# EAGLE design AK-MCP2221_V1.0 (EAGLE 7.6.0)
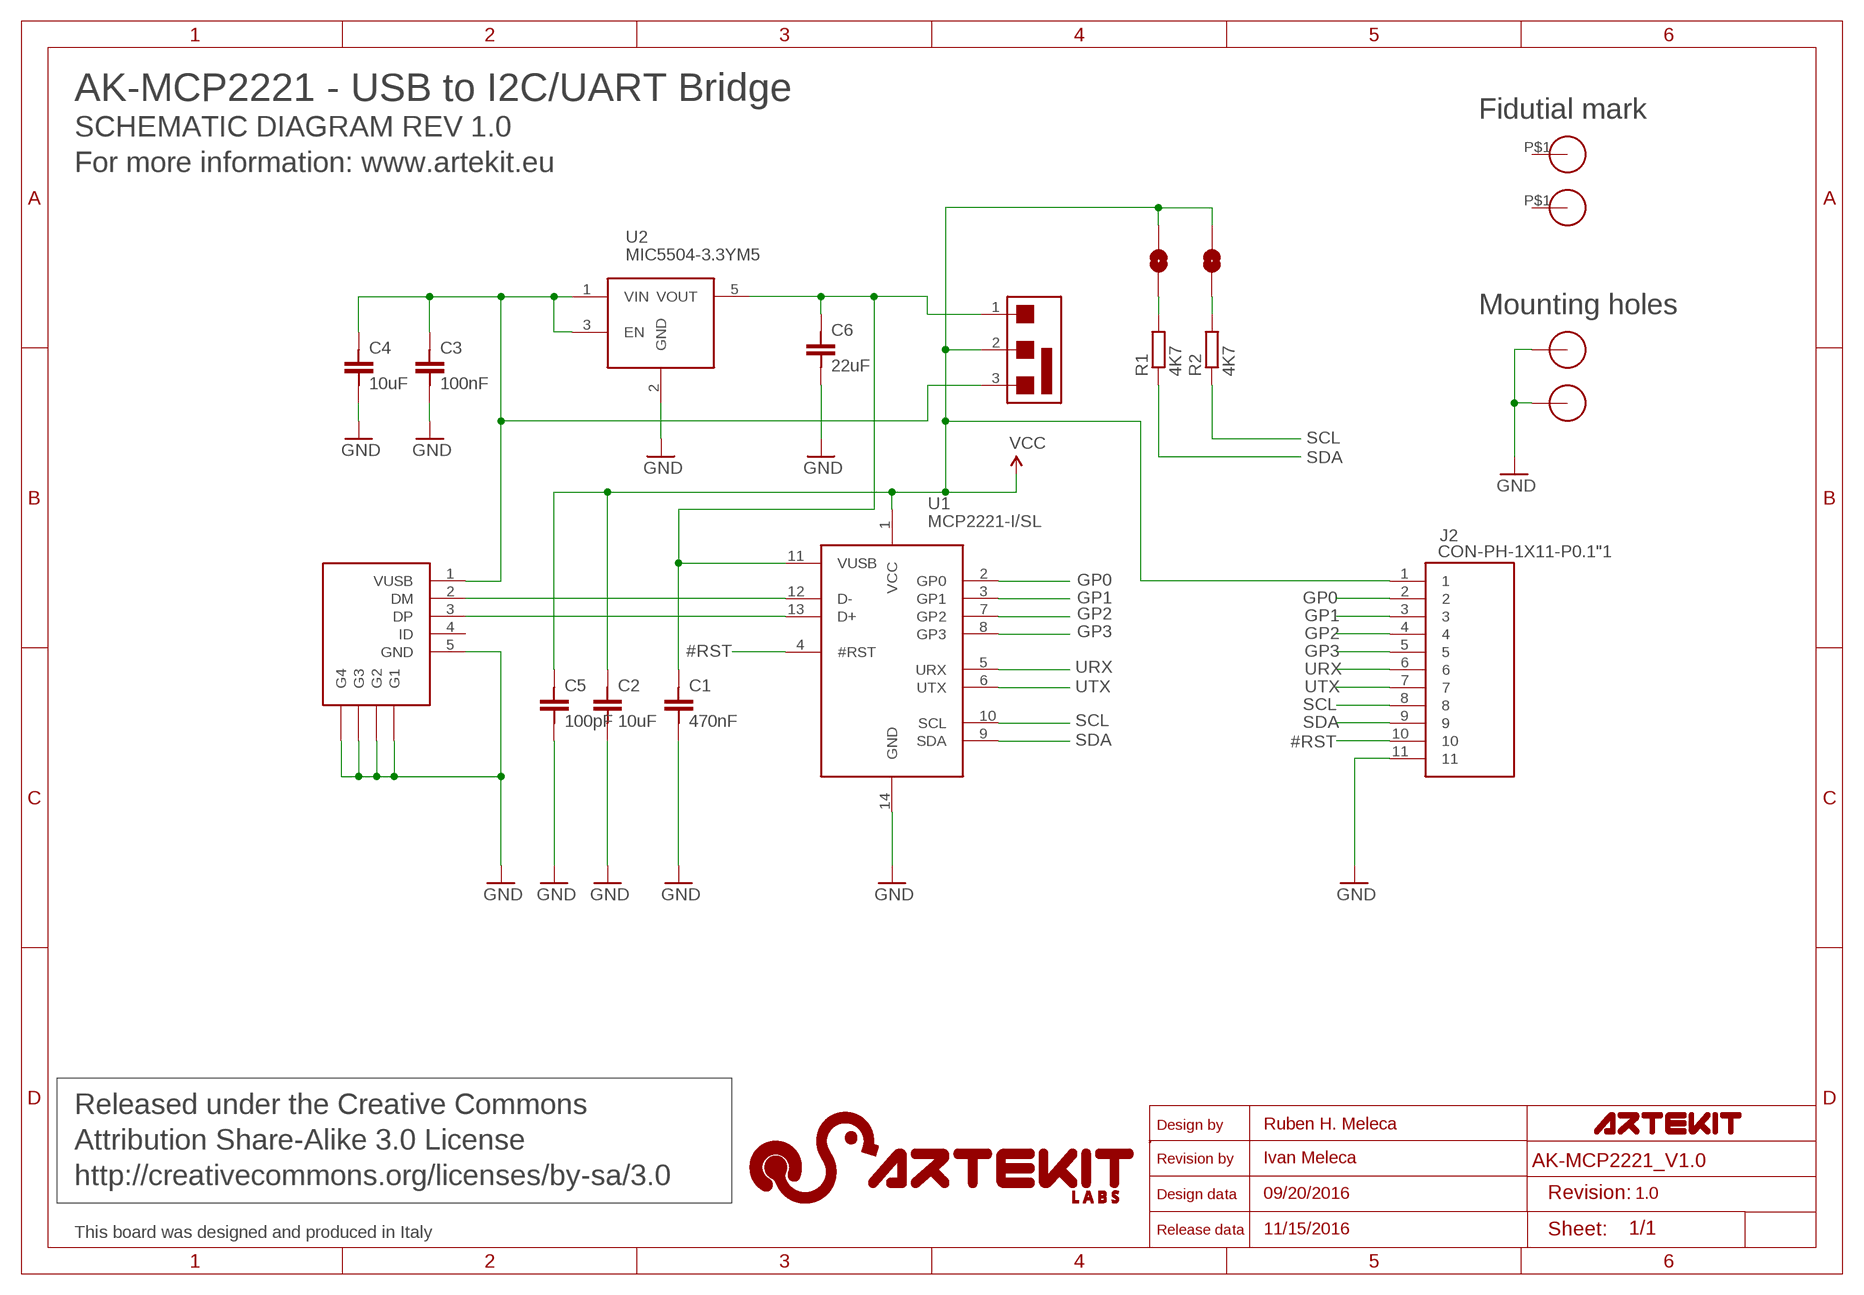
[diagram p0: schematic, sheet 1]

## Parts
C1  470nF  C0603  [C0603]
C2  10uF  C0603  [C0603]
C3  100nF  C0603  [C0603]
C4  10uF  C0805  [C0805]
C5  100pF  C0603  [C0603]
C6  22uF  C0805  [C0805]
J1  JUMPER-1-OPEN  [JUMPER-1-OPEN]
J2  CON-PH-1X11-P0.1"1  [PIN-HEADER-1X11]
J3  JUMPER-1-OPEN  [JUMPER-1-OPEN]
J4  CON-USB-MINI-B-SMD  [CON-USB-MINI-B-SMD]
R1  4K7  R0603  [R0603]
R2  4K7  R0603  [R0603]
SW1  SSSS810701  SLIDE-SWITCH-3-WAY  [SLIDE-SWITCH-3-WAY]
U1  MCP2221-I/SL  [SOICN-14]
U2  MIC5504-3.3YM5  [SOT23-5]
U$2  HOLE-2MM-METALIZED  [HOLE-2MM-METALIZED]
U$3  HOLE-2MM-METALIZED  [HOLE-2MM-METALIZED]
U$4  FIDUTIAL_1.2MM  [FIDUTIAL_1.2MM]
U$5  FIDUTIAL_1.2MM  [FIDUTIAL_1.2MM]

## Nets
#RST: J2.10 U1.4(#RST)
GND: C1.2 C2.2 C3.2 C4.2 C5.2 C6.2 J2.11 J4.5(GND) J4.C(G1) J4.D(G2) J4.E(G3) J4.F(G4) U1.14(GND) U2.2(GND) U$2.1 U$3.1
GP0: J2.2 U1.2(GP0)
GP1: J2.3 U1.3(GP1)
GP2: J2.4 U1.7(GP2)
GP3: J2.5 U1.8(GP3)
N$2: J4.2(DM) U1.12(D-)
N$3: J4.3(DP) U1.13(D+)
N$4: C3.1 C4.1 J4.1(VUSB) SW1.3 U2.1(VIN) U2.3(EN)
N$5: C1.1 C6.1 SW1.1 U1.11(VUSB) U2.5(VOUT)
N$6: J1.1 R1.2
N$7: J3.1 R2.2
SCL: J2.8 R2.1 U1.10(SCL)
SDA: J2.9 R1.1 U1.9(SDA)
URX: J2.6 U1.5(URX)
UTX: J2.7 U1.6(UTX)
VCC: C2.1 C5.1 J1.2 J2.1 J3.2 SW1.2 U1.1(VCC)
Unconnected: J4.4(ID) U$4.P$1 U$5.P$1

## Notes on the sheet
- AK-MCP2221 - USB to I2C/UART Bridge
- Fidutial mark
- SCHEMATIC DIAGRAM REV 1.0
- For more information: www.artekit.eu
- Mounting holes
- Released under the Creative Commons
- Ruben H. Meleca
- Attribution Share-Alike 3.0 License
- Ivan Meleca
- http://creativecommons.org/licenses/by-sa/3.0
- 09/20/2016 | 1.0
- This board was designed and produced in Italy | 11/15/2016

## Library data of the parts
C1-C3 C5 = ak:C0603: CAP SMD 0603 NP; MF: unknown; MPN: unknown
C4 = ak:C0805: CAP SMD 0805 NP; MF: unknown; MPN: unknown
C6 = artekit:C0805: CAP SMD 0805 NP; MF: unknown; MPN: unknown
J1 J3 = artekit:JUMPER-1-OPEN
J2 = ak:CON-PH-1X11-P0.1"
J4 = ak:CON-USB-MINI-B-SMD: USB-MINI SMD Connector; MF: EDAC; MPN: 690-005-299-143; OC_MOUSER: 587-690-005-299-143
R1 R2 = artekit:R0603: RES SMD 0603; MF: unknown; MPN: unknown
SW1 = artekit:SLIDE-SWITCH-3-WAY: 3-Way SMD Slide Switch; MF: ALPS; MPN: SSSS810701; OC_MOUSER: 688-SSSS810701
U1 = ak:MCP2221-I/SL: USB Interface IC USB to I2C Bridge Device; MF: Silicon Laboratories; MPN: MCP2221-I/SL
U2 = ak:MIC5504-3.3YM5: LDO Voltage Regulators Single 300mA LDO; MF: Micrel; MPN: MIC5504-3.3YM5; OC_MOUSER: 998-MIC5504-3.3YM5TR
U$2 U$3 = ak:HOLE-2MM-METALIZED: Metalized hole 2mm
U$4 U$5 = ak:FIDUTIAL_1.2MM

## Net classes
0 default: width 0.203 mm
1 power: width 0.254 mm

## Board
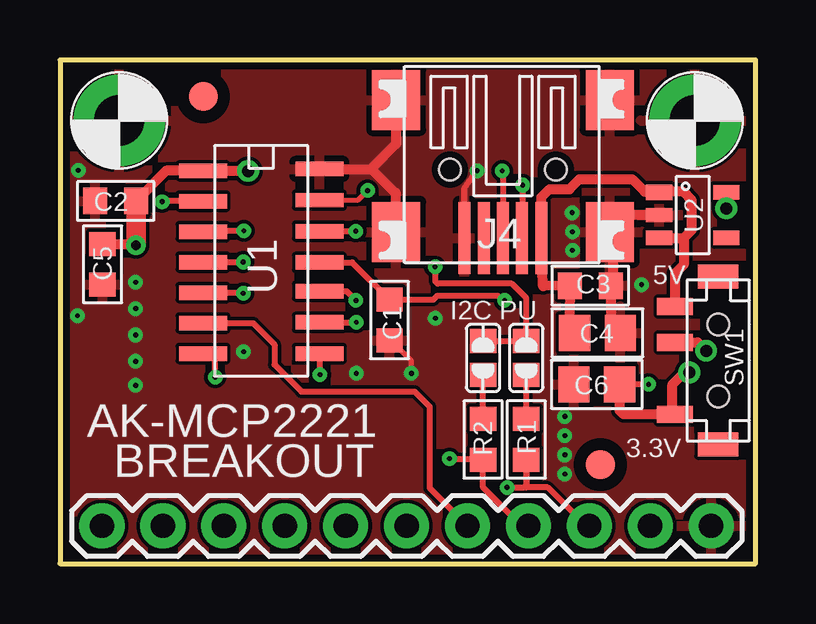
[diagram p1: board, top side]
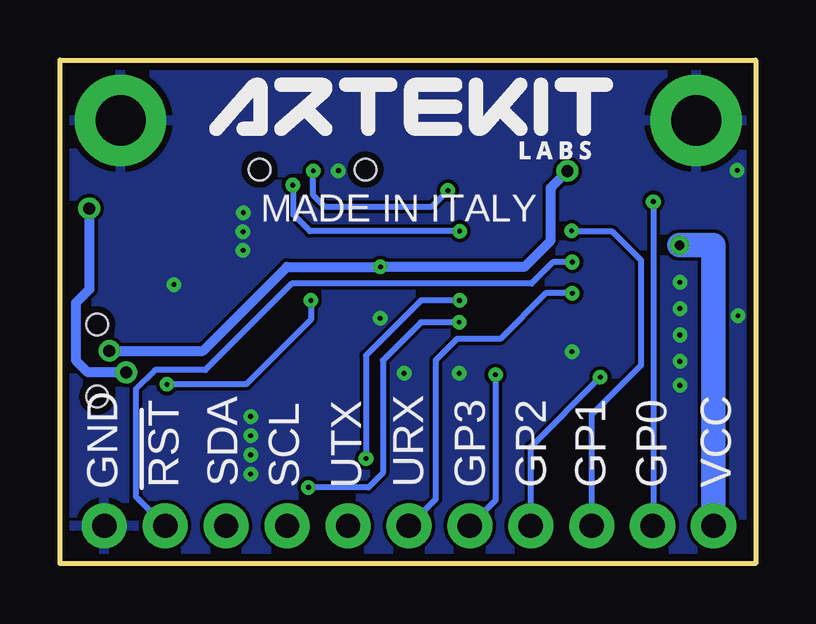
[diagram p2: board, bottom side, seen from below]

Size 29 x 21 mm. Coordinates in mm from the lower left corner, seen from the top.
Outline: 0,0 29,0 29,21 0,21 0,0
Copper layers (1*16): Top 0.035mm / dielectric 1.5mm / Bottom 0.035mm
Design rules "artekit *": minimum track width 0.15mm, minimum drill 0.2mm, track to track 0.15mm, track to pad 0.15mm, pad to pad 0.2mm, via to via 0.15mm, smd to smd 0mil, copper to edge 0.3mm, drill to drill 8mil, minimum pad ring 10mil, minimum via ring 8mil, stop-mask expansion 4mil, vias tented up to drill 20mil, thermal gap 10mil

### Footprints (pad centres in the part's own frame; a part is rotated, then mirrored left to right if it is on the bottom)
C0603 = smd 1 x 1.1: 1 -0.85,0; 2 0.85,0
C0805 = smd 1.3 x 1.5: 1 -0.99,0; 2 0.91,0
JUMPER-1-OPEN = smd 1 x 1.1: 1 -0.7,0; 2 0.7,0
PIN-HEADER-1X11 = drill 1.016 pad 1.88: 1 0,0; 2 2.54,0; 3 5.08,0; 4 7.62,0; 5 10.16,0; 6 12.7,0; 7 15.24,0; 8 17.78,0; 9 20.32,0; 10 22.86,0; 11 25.4,0
CON-USB-MINI-B-SMD = smd 0.5 x 3: 1 -1.6,0.25; 2 -0.8,0.25; 3 0,0.25; 4 0.8,0.25; 5 1.6,0.25 | smd 2 x 2.5: C -4.45,0; D 4.45,0; E -4.45,-5.5; F 4.45,-5.5 | hole 0.9: -2.2,-2.6; 2.2,-2.6
R0603 = smd 1 x 1.1: 1 -0.85,0; 2 0.85,0
SLIDE-SWITCH-3-WAY = smd 0.7 x 1.5: 1 -2.25,1.8; 2 0.75,1.8; 3 2.25,1.8 | smd 1 x 1.7: P$1 -3.5,0; P$2 3.5,0 | hole 0.9: -1.5,0; 1.5,0
SOICN-14 = smd 0.6 x 2: 1 -3.805,-2.525; 2 -2.535,-2.525; 3 -1.265,-2.525; 4 0.005,-2.525; 5 1.275,-2.525; 6 2.545,-2.525; 7 3.815,-2.525; 8 3.815,2.325; 9 2.515,2.325; 10 1.215,2.325; 11 0.015,2.325; 12 -1.285,2.325; 13 -2.585,2.325; 14 -3.885,2.325
SOT23-5 = smd 0.635 x 1.1: 1 -0.95,-1.4 | smd 0.6 x 1.1: 2 0,-1.4; 3 0.95,-1.4; 4 0.95,1.4; 5 -0.95,1.4
HOLE-2MM-METALIZED = drill 2.1 pad 3.81: 1 0,0
FIDUTIAL_1.2MM = smd 1.2 x 1.2: P$1 0,0

### Placement (x,y rotation side)
C1  13.74,10.15 270 top
C2  2.32,15.12 180 top
C3  22.11,11.59 0 top
C4  22.45,9.62 0 top
C5  1.78,12.48 270 top
C6  22.34,7.47 180 top
J1  19.44,8.57 90 top
J2  1.75,1.57 0 top
J3  17.64,8.57 90 top
J4  18.47,13.83 180 top
R1  19.44,5.17 90 top
R2  17.64,5.17 90 top
SW1  27.44,8.47 90 top
U1  8.49,12.57 270 top
U2  26.38,14.53 270 top
U$2  26.47,18.47 0 top
U$3  2.47,18.47 0 top
U$4  5.97,19.47 0 top
U$5  22.53,4.12 0 top

### Tracks (layer width: path | path; a pad name or v marks a point on that pad's centre or on a via)
#RST  (via drill 0.2)
  Top 0.25: U1.4 v7.63,12.57 v7.64,12.57
  Bottom 0.25: v7.64,12.57 8.44,12.57 9.34,11.67 19.34,11.67 22.94,8.07 25.04,8.07 25.84,7.27 25.84,2.8 J2.10
GND  (via drill 0.2)
  Top 0.2: C1.2 13.81,9.3 14.64,8.47 14.64,7.94 v14.65,7.93
  Top 0.25: J4.5 16.87,15.66 v17.39,16.38
  Top 0.406: U1.14 12.98,16.46 | 12.98,16.46 13,16.43 13.01,16.43 13.99,15.45 13.99,13.86 J4.D | J4.F 14.02,17.5 12.98,16.46 | U2.2 23.48,14.53 23.39,14.44 22.96,14.44 22.96,13.87 J4.C 23.05,13.7 23.05,11.68 C3.2 22.96,10.02 C4.2
  other vias: 21.35,14.63 21.37,13.83 21.37,13.06 24.25,11.63 21.05,6.13 21.05,5.33 21.05,4.53 21.05,3.73 15.65,10.23 12.35,7.93 0.73,10.33 3.15,11.73 3.15,10.63 3.15,9.53 3.15,8.43 3.15,7.43 7.65,8.83 0.76,16.4
  pour Top: -1.8,22.45 -1.76,-1.56 30.81,-1.76 30.81,22.45
  pour Bottom: -0.93,-0.73 29.81,-1.03 29.91,21.62 -0.83,21.69
GP0  (via drill 0.2)
  Top 0.25: U1.2 4.28,15.11 v4.26,15.09
  Bottom 0.25: v4.26,15.09 4.26,1.6 J2.2
GP1  (via drill 0.2)
  Top 0.25: v7.67,13.87 6,13.87 U1.3
  Bottom 0.25: J2.3 6.83,6.21 4.77,8.27 4.77,12.64 U1.3 7.64,13.84 v7.67,13.87
GP2  (via drill 0.2)
  Top 0.25: v6.47,7.77 6.47,8.67 6.57,8.77 5.98,8.77 U1.7
  Bottom 0.25: J2.4 9.37,4.87 v6.47,7.77
GP3  (via drill 0.2)
  Top 0.25: v10.84,7.87 10.84,8.73 U1.8
  Bottom 0.25: v10.84,7.87 10.84,2.64 J2.5
N$2  (via drill 0.2)
  Top 0.25: U1.12 v12.33,13.86 | v19.29,15.78 19.29,13.6 J4.2
  Bottom 0.25: v12.33,13.86 18.58,13.86 19.27,14.55 19.27,15.76 v19.29,15.78
N$3  (via drill 0.2)
  Top 0.2: U1.13 12.43,15.16 v12.83,15.56
  Top 0.25: v18.44,16.37 18.47,16.34 J4.3
  Bottom 0.25: v12.83,15.56 13.52,14.87 17.94,14.87 18.44,15.37 v18.44,16.37
N$4
  Top 0.406: U2.3 26,13.58 | C4.1 21.24,10.17 C3.1 20.14,11.57 J4.1 20.07,15.27 20.41,15.61 21.24,15.61 21.65,16.02 23.86,16.02 24.38,15.5 24.96,15.5 U2.1 25,15.5 25.98,15.5 26.34,15.14 26.34,13.9 26.02,13.58 26,13.58 | 26,13.58 26,12.46 25.64,12.1 SW1.3
N$5  (via drill 0.2, 0.5)
  Top 0.25: U1.11 12.19,12.56 C1.1 15.57,11 15.74,11.17 18.24,11.17 v18.54,10.97 | v24.54,7.47 C6.1
  Top 0.406: U2.5 v27.78,14.81 | v26.24,7.97 26.04,7.97 25.54,7.47 25.54,6.32 SW1.1 23.49,6.22 23.34,6.37 C6.1
  Bottom 0.25: v18.54,10.97 18.54,10.17 21.24,7.47 v24.54,7.47
  Bottom 0.406: v27.78,14.81 27.78,11.43 28.34,10.87 28.34,8.47 27.84,7.97 v26.24,7.97
N$6
  Top 0.25: R1.2 J1.1
N$7
  Top 0.25: R2.2 J3.1
SCL  (via drill 0.2)
  Top 0.25: J2.8 19.44,1.57 19.34,1.67 19.14,1.67 17.64,3.17 R2.1 17.59,4.37 v16.24,4.37 | U1.10 11.96,11.36 v12.34,10.97
  Bottom 0.25: v12.34,10.97 13.94,10.97 16.24,8.67 v16.24,4.37
SDA  (via drill 0.2)
  Top 0.25: U1.9 v12.35,10.06 | J2.9 21.94,1.57 20.34,3.17 19.44,3.17 R1.1 19.44,3.27 19.34,3.17 v18.64,3.17
  Bottom 0.25: v12.35,10.06 13.95,10.06 15.54,8.47 15.54,3.77 16.14,3.17 v18.64,3.17
URX  (via drill 0.2)
  Top 0.25: U1.5 7.62,11.3 v7.64,11.27
  Bottom 0.25: v7.64,11.27 8.74,11.27 10.64,9.37 12.44,9.37 13.34,8.47 13.34,2.68 J2.6
UTX
  Top 0.25: U1.6 8.06,10.03 8.94,9.14 8.94,8.3 10.07,7.17 14.79,7.17 15.41,6.55 15.41,3.15 J2.7
VCC  (via drill 0.2, 0.4, 0.5)
  Top 0.25: J3.2 J1.2 19.44,11.07 18.84,11.67 15.74,11.67 15.64,11.77 v15.64,12.37
  Top 0.406: C2.1 4.43,16.38 U1.1 v7.84,16.37 | SW1.2 26.59,9.22 v26.94,8.87 | C5.1 3.11,13.33 v3.17,13.27
  Top 0.813: C2.1 v3.17,13.27
  Bottom 0.406: v26.94,8.87 23.04,8.87 19.54,12.37 v15.64,12.37 9.64,12.37 8.54,13.47 8.54,15.67 v7.84,16.37
  Bottom 1.016: J2.1 1.77,1.57 1.77,13.27 v3.17,13.27

### Text on the board
tPlace: 5V | I2C PU | AK-MCP2221 | BREAKOUT | 3.3V
bPlace: MADE IN ITALY | VCC | GP0 | GP1 | GP2 | GP3 | URX | UTX | SCL | SDA | RST | GND
Document: All measures are in millimeters | 2.1